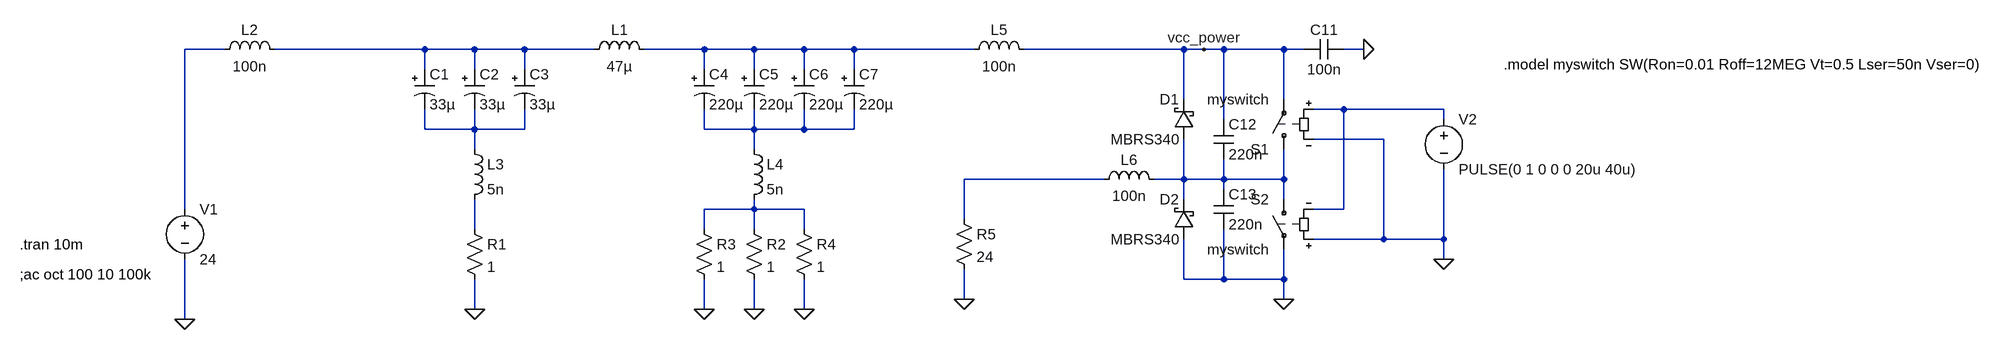
[diagram p0: schematic filter_power_01.asc]
filter_power_01.asc, the LTspice schematic file:
Version 4
SHEET 1 2704 680
WIRE -128 80 -192 80
WIRE 192 80 -48 80
WIRE 272 80 192 80
WIRE 352 80 272 80
WIRE 464 80 352 80
WIRE 640 80 544 80
WIRE 720 80 640 80
WIRE 800 80 720 80
WIRE 880 80 800 80
WIRE 1072 80 880 80
WIRE 1408 80 1152 80
WIRE 1440 80 1408 80
WIRE 1472 80 1440 80
WIRE 1568 80 1472 80
WIRE 1600 80 1568 80
WIRE 1696 80 1664 80
WIRE 192 112 192 80
WIRE 272 112 272 80
WIRE 352 112 352 80
WIRE 640 112 640 80
WIRE 720 112 720 80
WIRE 800 112 800 80
WIRE 880 112 880 80
WIRE 1408 160 1408 80
WIRE 1568 160 1568 80
WIRE 1664 176 1616 176
WIRE 1824 176 1664 176
WIRE 1472 192 1472 80
WIRE 1824 192 1824 176
WIRE 192 208 192 176
WIRE 272 208 272 176
WIRE 272 208 192 208
WIRE 352 208 352 176
WIRE 352 208 272 208
WIRE 640 208 640 176
WIRE 720 208 720 176
WIRE 720 208 640 208
WIRE 800 208 800 176
WIRE 800 208 720 208
WIRE 880 208 880 176
WIRE 880 208 800 208
WIRE 1728 224 1616 224
WIRE 272 240 272 208
WIRE 720 240 720 208
WIRE 1280 288 1056 288
WIRE 1408 288 1408 224
WIRE 1408 288 1360 288
WIRE 1472 288 1472 256
WIRE 1472 288 1408 288
WIRE 1568 288 1568 240
WIRE 1568 288 1472 288
WIRE 1472 304 1472 288
WIRE 1408 320 1408 288
WIRE 1568 320 1568 288
WIRE -192 336 -192 80
WIRE 720 336 720 320
WIRE 720 336 640 336
WIRE 800 336 720 336
WIRE 1664 336 1664 176
WIRE 1664 336 1616 336
WIRE 1056 352 1056 288
WIRE 272 368 272 320
WIRE 640 368 640 336
WIRE 720 368 720 336
WIRE 800 368 800 336
WIRE 1728 384 1728 224
WIRE 1728 384 1616 384
WIRE 1824 384 1824 272
WIRE 1824 384 1728 384
WIRE 1824 416 1824 384
WIRE 1408 448 1408 384
WIRE 1472 448 1472 368
WIRE 1472 448 1408 448
WIRE 1568 448 1568 400
WIRE 1568 448 1472 448
WIRE 1056 480 1056 432
WIRE 1568 480 1568 448
WIRE 272 496 272 448
WIRE 640 496 640 448
WIRE 720 496 720 448
WIRE 800 496 800 448
WIRE -192 512 -192 416
FLAG -192 512 0
FLAG 720 496 0
FLAG 272 496 0
FLAG 1440 80 vcc_power
FLAG 640 496 0
FLAG 800 496 0
FLAG 1824 416 0
FLAG 1568 480 0
FLAG 1056 480 0
FLAG 1696 80 0
SYMBOL voltage -192 320 R0
WINDOW 123 24 124 Left 2
WINDOW 39 0 0 Left 2
SYMATTR InstName V1
SYMATTR Value 24
SYMBOL ind 448 96 R270
WINDOW 0 32 56 VTop 2
WINDOW 3 5 56 VBottom 2
SYMATTR InstName L1
SYMATTR Value 47µ
SYMATTR SpiceLine Ipk=3.5 Rser=0.1089 Rpar=100k Cpar=0
SYMBOL res 256 352 R0
SYMATTR InstName R1
SYMATTR Value 1
SYMBOL res 704 352 R0
SYMATTR InstName R2
SYMATTR Value 1
SYMBOL ind -144 96 R270
WINDOW 0 32 56 VTop 2
WINDOW 3 5 56 VBottom 2
SYMATTR InstName L2
SYMATTR Value 100n
SYMBOL ind 256 224 R0
SYMATTR InstName L3
SYMATTR Value 5n
SYMBOL ind 704 224 R0
SYMATTR InstName L4
SYMATTR Value 5n
SYMBOL ind 1056 96 R270
WINDOW 0 32 56 VTop 2
WINDOW 3 5 56 VBottom 2
SYMATTR InstName L5
SYMATTR Value 100n
SYMBOL polcap 176 112 R0
WINDOW 3 24 56 Left 2
SYMATTR Value 33µ
SYMATTR InstName C1
SYMATTR Description Capacitor
SYMATTR Type cap
SYMATTR SpiceLine V=35 Irms=225m Rser=0.49 Lser=0 mfg="Nichicon" pn="UPL1V330MPH" type="Al electrolytic"
SYMBOL polcap 256 112 R0
WINDOW 3 24 56 Left 2
SYMATTR Value 33µ
SYMATTR InstName C2
SYMATTR Description Capacitor
SYMATTR Type cap
SYMATTR SpiceLine V=35 Irms=225m Rser=0.49 Lser=0 mfg="Nichicon" pn="UPL1V330MPH" type="Al electrolytic"
SYMBOL polcap 336 112 R0
WINDOW 3 24 56 Left 2
SYMATTR Value 33µ
SYMATTR InstName C3
SYMATTR Description Capacitor
SYMATTR Type cap
SYMATTR SpiceLine V=35 Irms=225m Rser=0.49 Lser=0 mfg="Nichicon" pn="UPL1V330MPH" type="Al electrolytic"
SYMBOL polcap 624 112 R0
WINDOW 3 24 56 Left 2
SYMATTR Value 220µ
SYMATTR InstName C4
SYMATTR Description Capacitor
SYMATTR Type cap
SYMATTR SpiceLine V=35 Irms=795m Rser=0.085 Lser=0 mfg="Nichicon" pn="UPL1V221MPH" type="Al electrolytic"
SYMBOL res 624 352 R0
SYMATTR InstName R3
SYMATTR Value 1
SYMBOL res 784 352 R0
SYMATTR InstName R4
SYMATTR Value 1
SYMBOL polcap 704 112 R0
WINDOW 3 24 56 Left 2
SYMATTR Value 220µ
SYMATTR InstName C5
SYMATTR Description Capacitor
SYMATTR Type cap
SYMATTR SpiceLine V=35 Irms=795m Rser=0.085 Lser=0 mfg="Nichicon" pn="UPL1V221MPH" type="Al electrolytic"
SYMBOL polcap 784 112 R0
WINDOW 3 24 56 Left 2
SYMATTR Value 220µ
SYMATTR InstName C6
SYMATTR Description Capacitor
SYMATTR Type cap
SYMATTR SpiceLine V=35 Irms=795m Rser=0.085 Lser=0 mfg="Nichicon" pn="UPL1V221MPH" type="Al electrolytic"
SYMBOL polcap 864 112 R0
WINDOW 3 24 56 Left 2
SYMATTR Value 220µ
SYMATTR InstName C7
SYMATTR Description Capacitor
SYMATTR Type cap
SYMATTR SpiceLine V=35 Irms=795m Rser=0.085 Lser=0 mfg="Nichicon" pn="UPL1V221MPH" type="Al electrolytic"
SYMBOL sw 1568 256 R180
SYMATTR InstName S1
SYMATTR Value myswitch
SYMBOL sw 1568 304 M0
SYMATTR InstName S2
SYMATTR Value myswitch
SYMBOL voltage 1824 176 R0
WINDOW 123 0 0 Left 2
WINDOW 39 0 0 Left 2
SYMATTR InstName V2
SYMATTR Value PULSE(0 1 0 0 0 20u 40u)
SYMBOL res 1040 336 R0
SYMATTR InstName R5
SYMATTR Value 24
SYMBOL schottky 1424 224 R180
WINDOW 0 24 64 Left 2
WINDOW 3 24 0 Left 2
SYMATTR InstName D1
SYMATTR Value MBRS340
SYMATTR Description Diode
SYMATTR Type diode
SYMBOL schottky 1424 384 R180
WINDOW 0 24 64 Left 2
WINDOW 3 24 0 Left 2
SYMATTR InstName D2
SYMATTR Value MBRS340
SYMATTR Description Diode
SYMATTR Type diode
SYMBOL ind 1264 304 R270
WINDOW 0 32 56 VTop 2
WINDOW 3 5 56 VBottom 2
SYMATTR InstName L6
SYMATTR Value 100n
SYMBOL cap 1664 64 R90
WINDOW 0 0 32 VBottom 2
WINDOW 3 32 32 VTop 2
SYMATTR InstName C11
SYMATTR Value 100n
SYMBOL cap 1456 192 R0
SYMATTR InstName C12
SYMATTR Value 220n
SYMBOL cap 1456 304 R0
SYMATTR InstName C13
SYMATTR Value 220n
TEXT -456 440 Left 2 !;ac oct 100 10 100k
TEXT -456 392 Left 2 !.tran 10m
TEXT 1920 104 Left 2 !.model myswitch SW(Ron=0.01 Roff=12MEG Vt=0.5 Lser=50n Vser=0)

The netlist it stands for:
* filter_power_01.asc
V1 N001 0 24
L1 N002 N003 47µ Ipk=3.5 Rser=0.1089 Rpar=100k Cpar=0
R1 N010 0 1
R2 N009 0 1
L2 N001 N002 100n
L3 N005 N010 5n
L4 N006 N009 5n
L5 N003 vcc_power 100n
C1 N002 N005 33µ V=35 Irms=225m Rser=0.49 Lser=0 mfg="Nichicon" pn="UPL1V330MPH" type="Al electrolytic"
C2 N002 N005 33µ V=35 Irms=225m Rser=0.49 Lser=0 mfg="Nichicon" pn="UPL1V330MPH" type="Al electrolytic"
C3 N002 N005 33µ V=35 Irms=225m Rser=0.49 Lser=0 mfg="Nichicon" pn="UPL1V330MPH" type="Al electrolytic"
C4 N003 N006 220µ V=35 Irms=795m Rser=0.085 Lser=0 mfg="Nichicon" pn="UPL1V221MPH" type="Al electrolytic"
R3 N009 0 1
R4 N009 0 1
C5 N003 N006 220µ V=35 Irms=795m Rser=0.085 Lser=0 mfg="Nichicon" pn="UPL1V221MPH" type="Al electrolytic"
C6 N003 N006 220µ V=35 Irms=795m Rser=0.085 Lser=0 mfg="Nichicon" pn="UPL1V221MPH" type="Al electrolytic"
C7 N003 N006 220µ V=35 Irms=795m Rser=0.085 Lser=0 mfg="Nichicon" pn="UPL1V221MPH" type="Al electrolytic"
S1 N008 vcc_power N004 0 myswitch
S2 N008 0 0 N004 myswitch
V2 N004 0 PULSE(0 1 0 0 0 20u 40u)
R5 N007 0 24
D1 N008 vcc_power MBRS340
D2 0 N008 MBRS340
L6 N007 N008 100n
C11 0 vcc_power 100n
C12 vcc_power N008 220n
C13 N008 0 220n
.model D D
.lib standard.dio
;ac oct 100 10 100k
.tran 10m
.model myswitch SW(Ron=0.01 Roff=12MEG Vt=0.5 Lser=50n Vser=0)
.backanno
.end